# EasyEDA schematic LM471-2-feb-15.json
TITLE: Sheet_1; REV: 1.0; Date: 2024-01-02; Sheet: 1/1; Company: Your Company
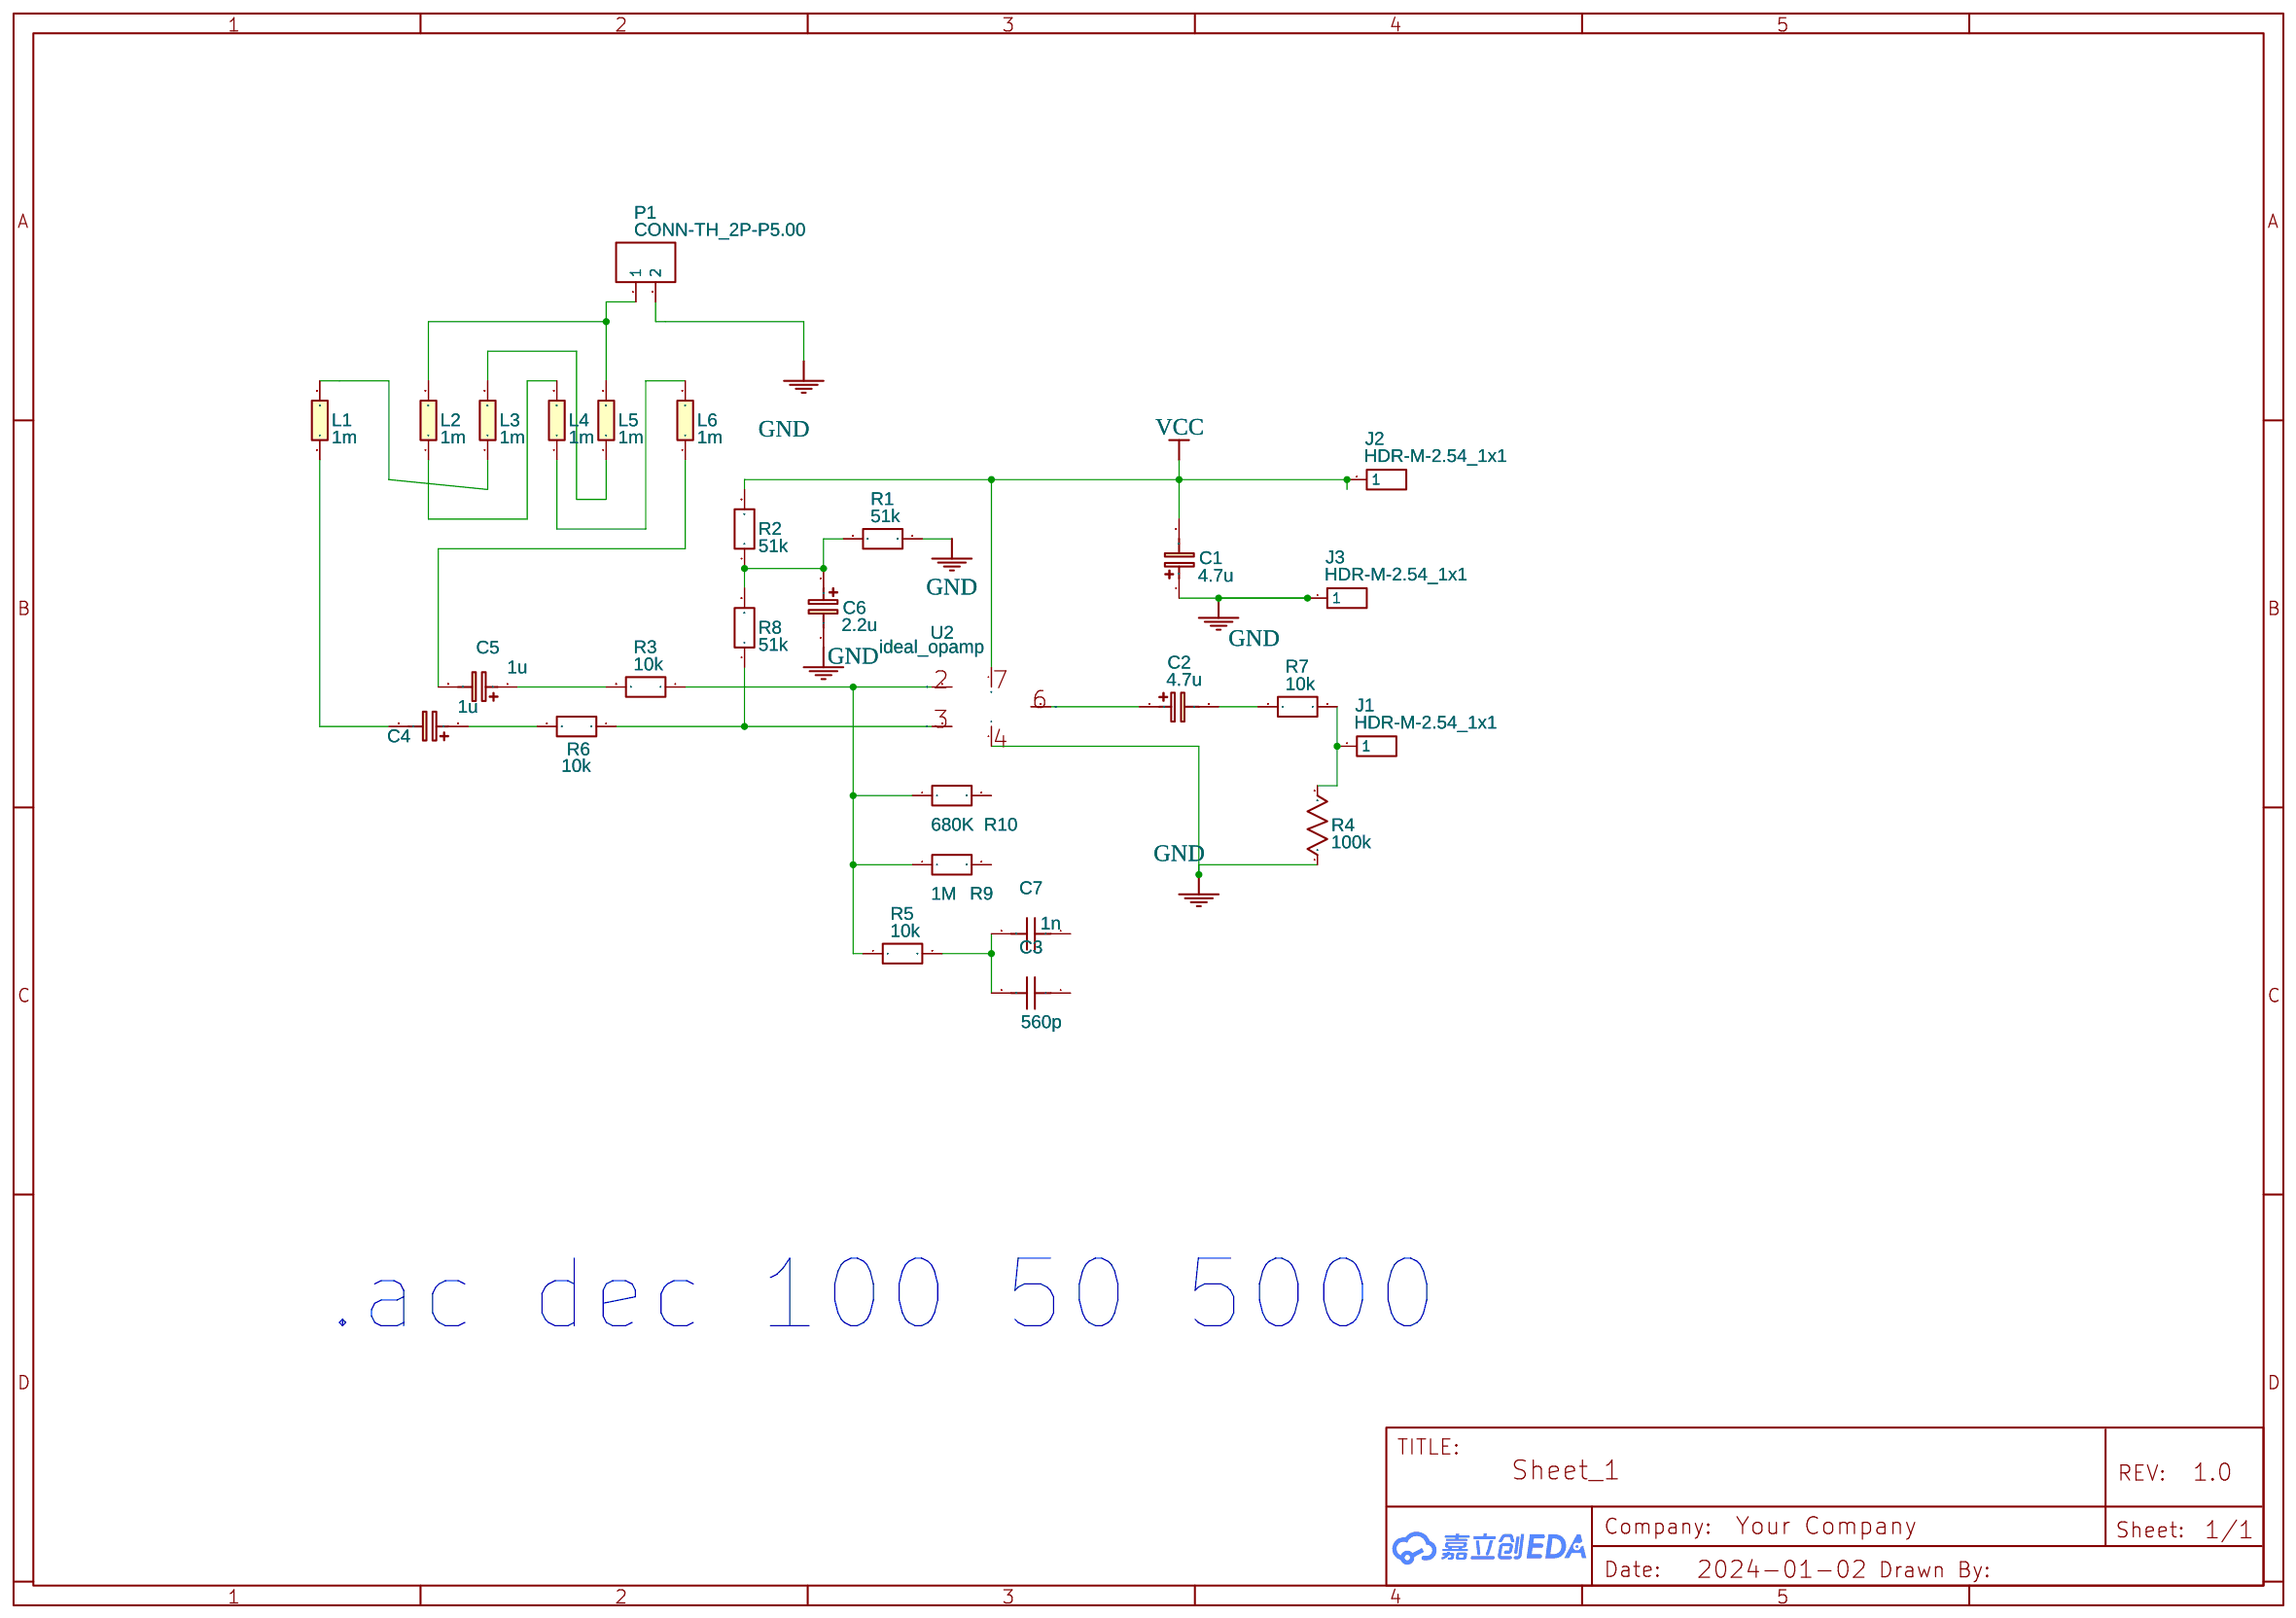
[diagram p0: schematic sheet]

## Parts
C1  4.7u  [CAPACITOR_SMD0805_HANDSOLDERING_REVA_DATE21JUN2010]
C2  4.7u  [CAPACITOR_SMD0805_HANDSOLDERING_REVA_DATE21JUN2010]
C3  560p  [CAPACITOR_SMD0805_HANDSOLDERING_REVA_DATE21JUN2010]
C4  1u  [CAPACITOR_SMD0805_HANDSOLDERING_REVA_DATE21JUN2010]
C5  1u  [CAPACITOR_SMD0805_HANDSOLDERING_REVA_DATE21JUN2010]
C6  2.2u  [CAPACITOR_SMD0805_HANDSOLDERING_REVA_DATE21JUN2010]
C7  1n  [CAPACITOR_SMD0805_HANDSOLDERING_REVA_DATE21JUN2010]
J1  HDR-M-2.54_1x1  [HDR-M-2.54_1X1]
J2  HDR-M-2.54_1x1  [HDR-M-2.54_1X1]
J3  HDR-M-2.54_1x1  [HDR-M-2.54_1X1]
L1  1m  [L_COILCRAFT_XAL5030]
L2  1m  [L_COILCRAFT_XAL5030]
L3  1m  [L_COILCRAFT_XAL5030]
L4  1m  [L_COILCRAFT_XAL5030]
L5  1m  [L_COILCRAFT_XAL5030]
L6  1m  [L_COILCRAFT_XAL5030]
P1  CONN-TH_2P-P5.00  [CONN-TH_2P-P5.00]
R1  51k  [R0603]
R2  51k  [R0603]
R3  10k  [R0603]
R4  100k  [AXIAL-0.3]
R5  10k  [R0603]
R6  10k  [R0603]
R7  10k  [R0603]
R8  51k  [R0603]
R9  1M  [R0603]
R10  680K  [R0603]
U2  ideal_opamp  [TL071H]

## Library data of the parts
C1 C2 C4-C6 = C_Tan_SMD_A_EU: Contributor: LCEDA_Lib
C3 C7 = Capacitor_US: Contributor: EasyEDA; Supplier: YUJING; Capacitance: 1u
J1-J3 = HDR-M-2.54_1x1: Supplier Part: C81276; Supplier: LCSC; Contributor: LCEDA_Lib
L1-L6 = L0603_EU: Contributor: LCEDA_Lib
P1 = CONN-TH_2P-P5.00: Supplier: LCSC; Contributor: LCEDA_Lib
R1-R3 R5-R10 = R_0603_EU: Contributor: LCEDA_Lib
R4 = Resistor_US: Resistance: 1k; Contributor: EasyEDA; Supplier: YUJING
U2 = LM741: Contributor: juan_g2; sim: true

## Nets
GND: C1.1 C6.2 J3.1 P1.2 R1.1 R4.1 U2.4(V-)
VCC: C1.2 J2.1 R2.2 U2.7(V+)
Net-(C2-1): C2.1 U2.6(OUT)
Net-(C2-2): C2.2 R7.1
Net-(C3-2): C3.2 C7.2 R5.2
Net-(C4-1): C4.1 R6.2
Net-(C4-2): C4.2 L1.1
Net-(C5-1): C5.1 R3.2
Net-(C5-2): C5.2 L6.1
Net-(C6-1): C6.1 R1.2 R2.1 R8.2
Net-(J1-1): J1.1 R4.2 R7.2
Net-(L1-2): L1.2 L3.1
Net-(L2-1): L2.1 L4.2
Net-(L2-2): L2.2 L5.2 P1.1
Net-(L3-2): L3.2 L5.1
Net-(L4-1): L4.1 L6.2
Net-(R3-1): R3.1 R5.1 R9.1 R10.1 U2.2(IN-)
Net-(R6-1): R6.1 R8.1 U2.3(IN+)

Not connected (* = marked no-connect by the designer): C3 1; C7 1; R9 2; R10 2

## Notes on the sheet
- .ac dec 100 50 5000
